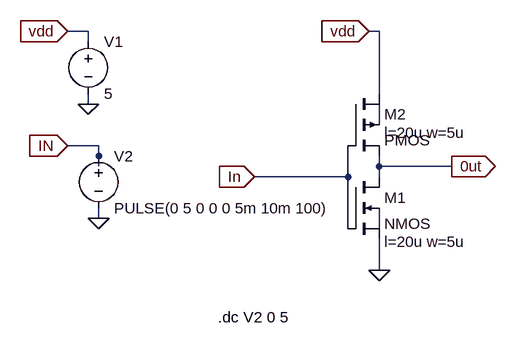
[diagram p0: schematic cmos_using_LTSpice.asc]
cmos_using_LTSpice.asc, the LTspice schematic file:
Version 4
SHEET 1 880 680
WIRE -224 -144 -256 -144
WIRE 224 -144 208 -144
WIRE -224 -128 -224 -144
WIRE 224 -48 224 -144
WIRE -224 -32 -224 -48
WIRE 224 0 224 -32
WIRE -208 32 -256 32
WIRE -208 48 -208 32
WIRE -208 64 -208 48
WIRE 224 64 224 48
WIRE 336 64 224 64
WIRE 176 80 176 32
WIRE 176 80 32 80
WIRE 224 80 224 64
WIRE -208 144 -208 128
WIRE 176 160 176 80
WIRE 224 160 224 128
WIRE 224 224 224 176
FLAG 336 64 0ut
IOPIN 336 64 Out
FLAG 224 224 0
FLAG 32 80 In
IOPIN 32 80 In
FLAG 208 -144 vdd
IOPIN 208 -144 In
FLAG -256 -144 vdd
IOPIN -256 -144 In
FLAG -224 -32 0
FLAG -208 144 0
FLAG -256 32 IN
IOPIN -256 32 In
SYMBOL nmos4 176 80 R0
WINDOW 123 56 100 Left 2
SYMATTR Value2 l=20u w=5u
SYMATTR InstName M1
SYMBOL pmos4 176 -48 R0
WINDOW 123 56 60 Left 2
SYMATTR Value2 l=20u w=5u
SYMATTR InstName M2
SYMBOL voltage -224 -144 R0
WINDOW 123 0 0 Left 0
WINDOW 39 0 0 Left 0
SYMATTR InstName V1
SYMATTR Value 5
SYMBOL voltage -208 32 R0
WINDOW 123 0 0 Left 0
WINDOW 39 0 0 Left 0
SYMATTR InstName V2
SYMATTR Value PULSE(0 5 0 0 0 5m 10m 100)
TEXT -24 296 Left 2 !.dc V2 0 5

The netlist it stands for:
* cmos_using_LTSpice.asc
M1 0ut In 0 N002 NMOS l=20u w=5u
M2 vdd In 0ut N001 PMOS l=20u w=5u
V1 vdd 0 5
V2 In 0 PULSE(0 5 0 0 0 5m 10m 100)
.model NMOS NMOS
.model PMOS PMOS
.lib standard.mos
.dc V2 0 5
.backanno
.end